# Altium schematic sheet 11_RK3128_CODEC_HDMI_DAC.SchDoc
size 420 x 297 mm
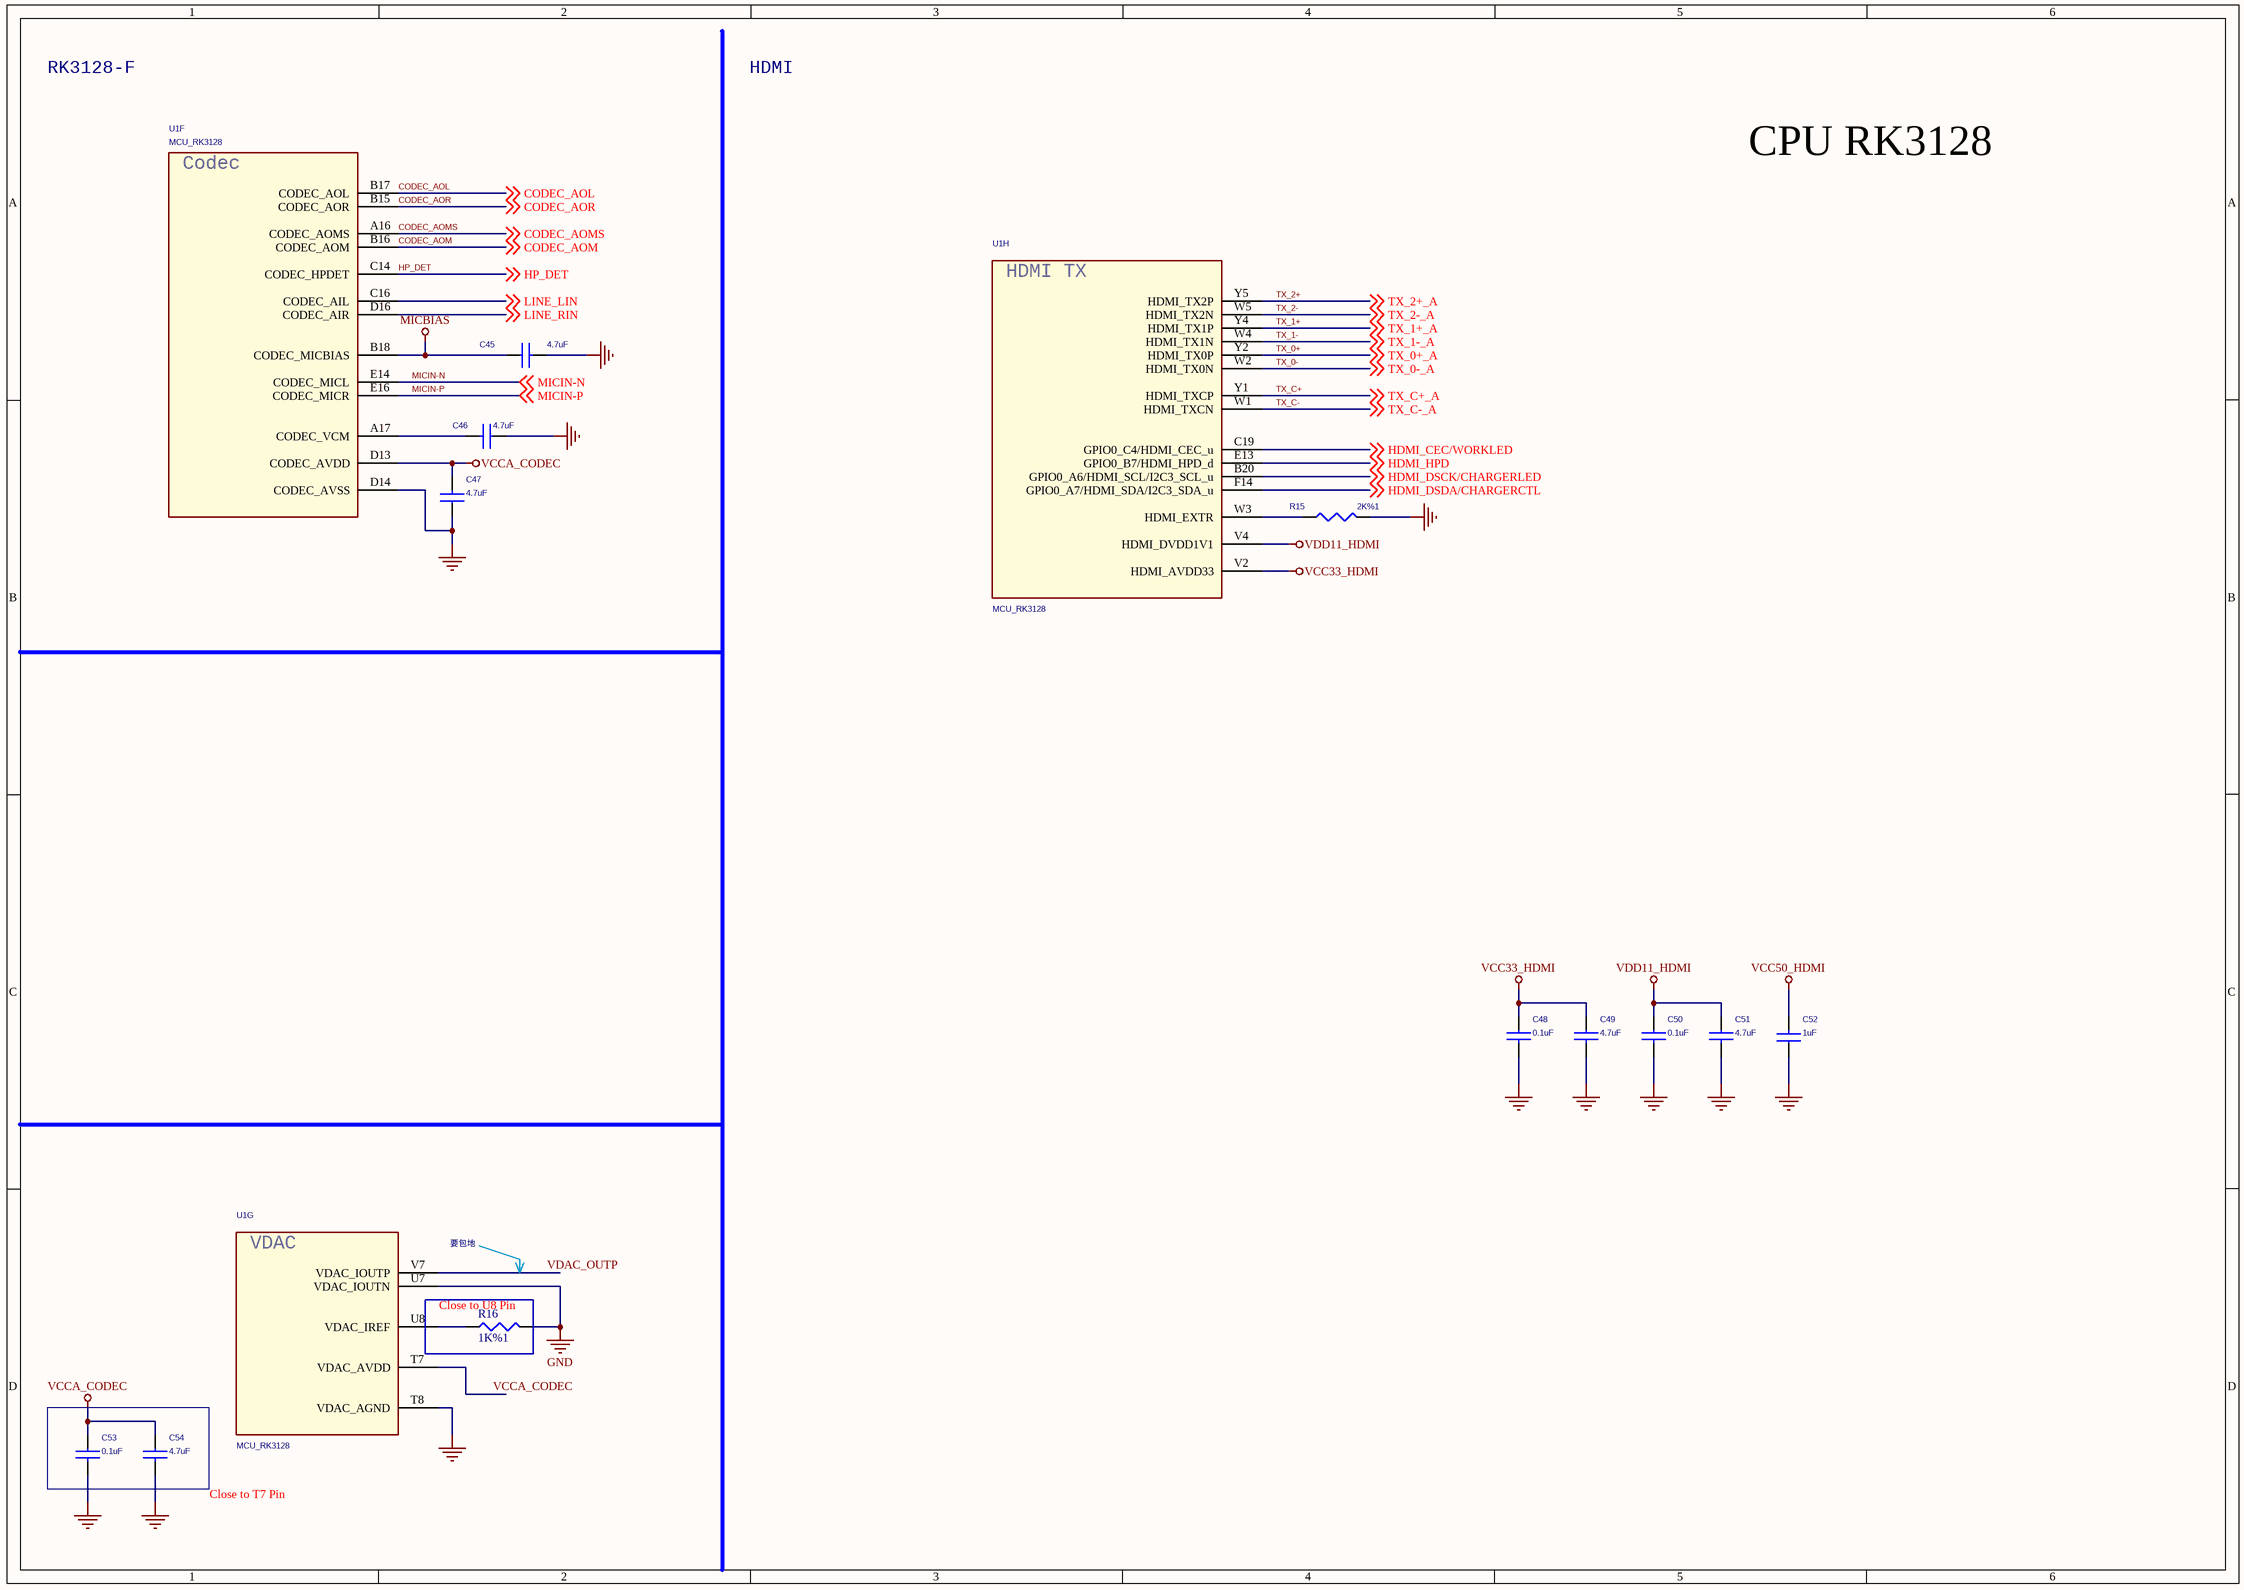
[diagram p0: 11_RK3128_CODEC_HDMI_DAC.SchDoc]

## Parts
C45  4.7uF  [C0603]
C46  4.7uF  [C0603]
C47  4.7uF  [C0603]
C48  0.1uF  [C0402]
C49  4.7uF  [C0603]
C50  0.1uF  [C0402]
C51  4.7uF  [C0603]
C52  1uF  [C0402]
C53  0.1uF  [C0402]
C54  4.7uF  [C0603]
R15  2K%1  [R0402]
R16  1K%1  [R0402]
U1  MCU_RK3128  [BGA316-14X14-0.65]  (parts F,G,H of 12)

## Blocks framed on the sheet
Close to U8 Pin: R16

## Nets
GND: C45.2 C46.1 C47.1 C48.2 C49.2 C50.2 C51.2 C52.1 C53.2 C54.2 R15.1 R16.2 U1.D14(CODEC_AVSS) U1.T8(VDAC_AGND) U1.U7(VDAC_IOUTN)
MICBIAS: C45.1 U1.B18(CODEC_MICBIAS)
VCC33_HDMI: C48.1 C49.1 U1.V2(HDMI_AVDD33)
VCC50_HDMI: C52.2
VCCA_CODEC: C47.2 C53.1 C54.1 U1.D13(CODEC_AVDD) U1.T7(VDAC_AVDD)
VDD11_HDMI: C50.1 C51.1 U1.V4(HDMI_DVDD1V1)
CODEC_AOL: U1.B17(CODEC_AOL) ; off-sheet CODEC_AOL
CODEC_AOM: U1.B16(CODEC_AOM) ; off-sheet CODEC_AOM
CODEC_AOMS: U1.A16(CODEC_AOMS) ; off-sheet CODEC_AOMS
CODEC_AOR: U1.B15(CODEC_AOR) ; off-sheet CODEC_AOR
HDMI_CEC/WORKLED: U1.C19(GPIO0_C4/HDMI_CEC_u) ; off-sheet HDMI_CEC/WORKLED
HDMI_DSCK/CHARGERLED: U1.B20(GPIO0_A6/HDMI_SCL/I2C3_SCL_u) ; off-sheet HDMI_DSCK/CHARGERLED
HDMI_DSDA/CHARGERCTL: U1.F14(GPIO0_A7/HDMI_SDA/I2C3_SDA_u) ; off-sheet HDMI_DSDA/CHARGERCTL
HDMI_HPD: U1.E13(GPIO0_B7/HDMI_HPD_d) ; off-sheet HDMI_HPD
HP_DET: U1.C14(CODEC_HPDET) ; off-sheet HP_DET
LINE_LIN: U1.C16(CODEC_AIL) ; off-sheet LINE_LIN
LINE_RIN: U1.D16(CODEC_AIR) ; off-sheet LINE_RIN
MICIN-N: U1.E14(CODEC_MICL) ; off-sheet MICIN-N
MICIN-P: U1.E16(CODEC_MICR) ; off-sheet MICIN-P
TX_0+: U1.Y2(HDMI_TX0P) ; off-sheet TX_0+_A  [also labelled TX_0+_A]
TX_0-: U1.W2(HDMI_TX0N) ; off-sheet TX_0-_A  [also labelled TX_0-_A]
TX_1+: U1.Y4(HDMI_TX1P) ; off-sheet TX_1+_A  [also labelled TX_1+_A]
TX_1-: U1.W4(HDMI_TX1N) ; off-sheet TX_1-_A  [also labelled TX_1-_A]
TX_2+: U1.Y5(HDMI_TX2P) ; off-sheet TX_2+_A  [also labelled TX_2+_A]
TX_2-: U1.W5(HDMI_TX2N) ; off-sheet TX_2-_A  [also labelled TX_2-_A]
TX_C+: U1.Y1(HDMI_TXCP) ; off-sheet TX_C+_A  [also labelled TX_C+_A]
TX_C-: U1.W1(HDMI_TXCN) ; off-sheet TX_C-_A  [also labelled TX_C-_A]
VDAC_OUTP: U1.V7(VDAC_IOUTP)
NetC46_2: C46.2 U1.A17(CODEC_VCM)
NetR15_2: R15.2 U1.W3(HDMI_EXTR)
NetR16_1: R16.1 U1.U8(VDAC_IREF)

## Notes on the sheet
- RK3128-F
- HDMI
- CPU RK3128
- 要包地
- Close to T7 Pin
- (in symbol MCU_RK3128, part F) Codec
- (in symbol MCU_RK3128, part G) VDAC
- (in symbol MCU_RK3128, part H) HDMI TX

## Library data of the parts
C45 C48-C51 C53 C54 = CAP NP
C46 = CAP NP: CAP,MLCC,10uF,+/-10%,X5R,16V,SMD0805
C47 = CAP NP: RoHS CHIP CAP 0.1uF +10/-10% X7R
C52 = CAP NP: RoHS CHIP CAP 1uF +10/-10% X5R
R15 = RESISTOR_0: RES,thick film,3.5KOhm,+/-5%,1/16W,SMD0402
R16 = RESISTOR: 1K %1 R0402